# EAGLE design avrisp (EAGLE 4.15)
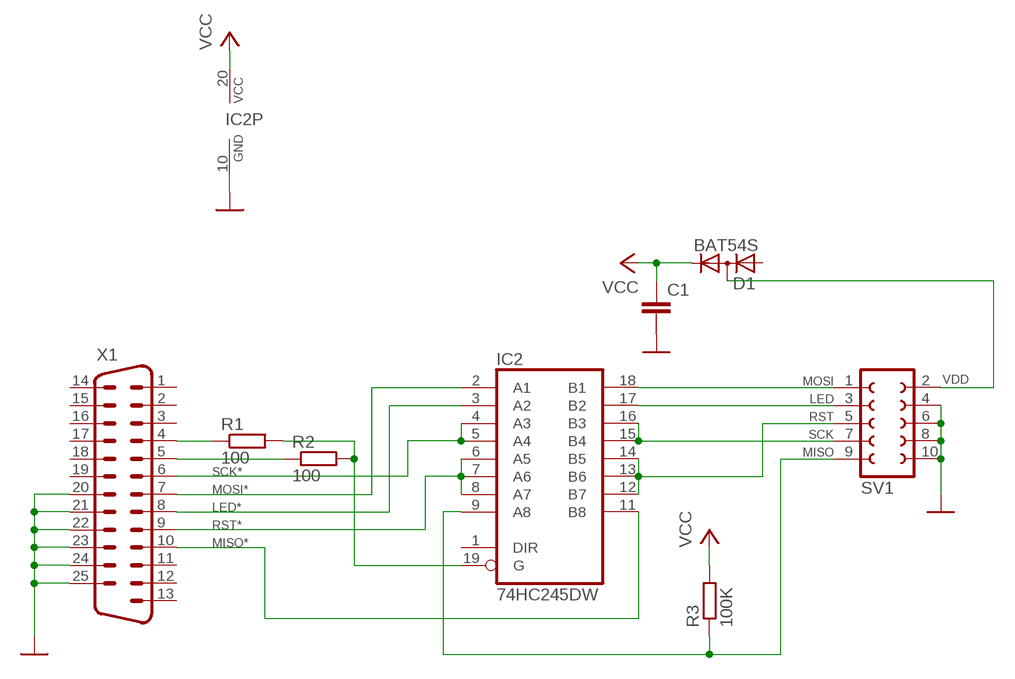
[diagram p0: schematic, sheet 1]

## Parts
C1  C-EUC0805  [C0805]
D1  BAT54S  DIODE_2CACA-SOT23  [SOT23]
IC2  74HC245DW  [SO20W]
R1  100  R-EU_R0805  [R0805]
R2  100  R-EU_R0805  [R0805]
R3  100K  R-EU_R0805  [R0805]
SV1  FE05-2  [FE05-2]
X1  M25H  [M25H]

## Nets
GND: C1.2 IC2.10(GND) SV1.4 SV1.6 SV1.8 SV1.10 X1.20 X1.21 X1.22 X1.23 X1.24 X1.25
LED: IC2.17(B2) SV1.3
LED*: IC2.3(A2) X1.8
MISO: IC2.9(A8) R3.1 SV1.9
MISO*: IC2.11(B8) X1.10
MOSI: IC2.18(B1) SV1.1
MOSI*: IC2.2(A1) X1.7
N$1: R1.1 X1.4
N$2: R2.1 X1.5
N$3: IC2.19(G) R1.2 R2.2
RST: IC2.12(B7) IC2.13(B6) IC2.14(B5) SV1.5
RST*: IC2.6(A5) IC2.7(A6) IC2.8(A7) X1.9
SCK: IC2.15(B4) IC2.16(B3) SV1.7
SCK*: IC2.4(A3) IC2.5(A4) X1.6
VCC: C1.1 D1.2(C) IC2.20(VCC) R3.2
VDD: D1.3(AC) SV1.2
Unconnected: D1.1(A) IC2.1(DIR) X1.1 X1.2 X1.3 X1.11 X1.12 X1.13 X1.14 X1.15 X1.16 X1.17 X1.18 X1.19

## Library data of the parts
C1 = rcl:C-EU: CAPACITOR, European symbol
D1 = diode:DIODE_2CACA-: 2 Diodes - Cathode-Anode|Cathode-Anode
IC2 = 74xx-eu:74*245: Octal BUS TRANSCEIVER, 3-state
R1-R3 = rcl:R-EU_: RESISTOR, European symbol
SV1 = con-lsta:FE05-2: FEMALE HEADER
X1 = con-subd:M25: SUB-D

## Net classes
0 default: width 0.5 mm

## Board
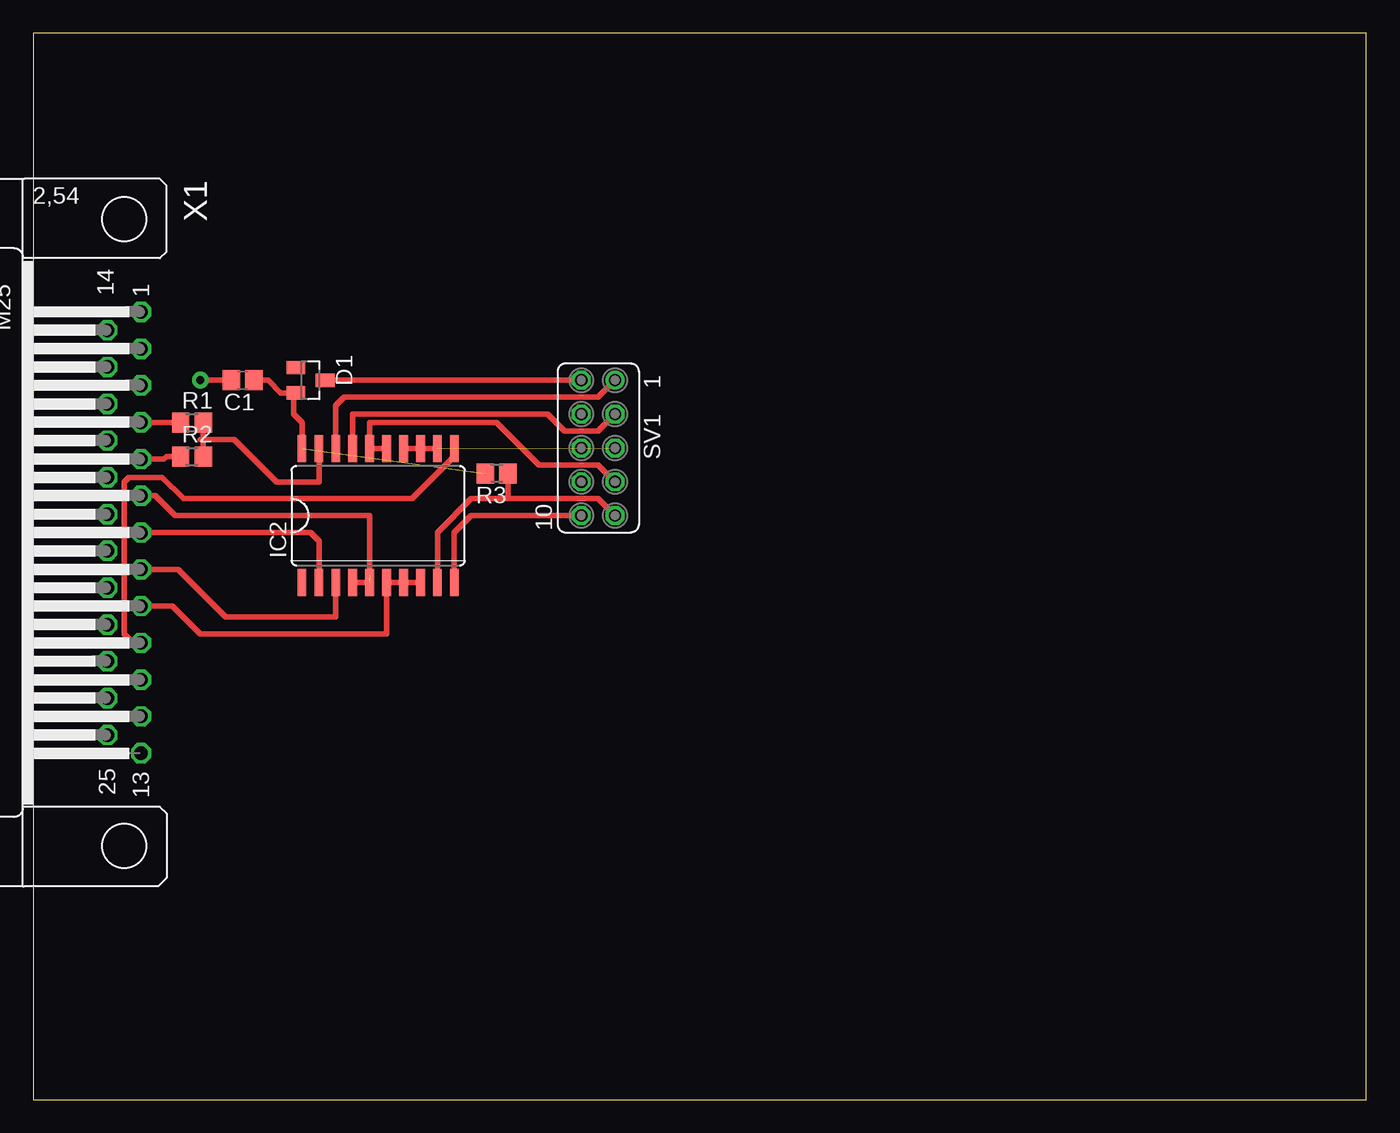
[diagram p1: board, top side]
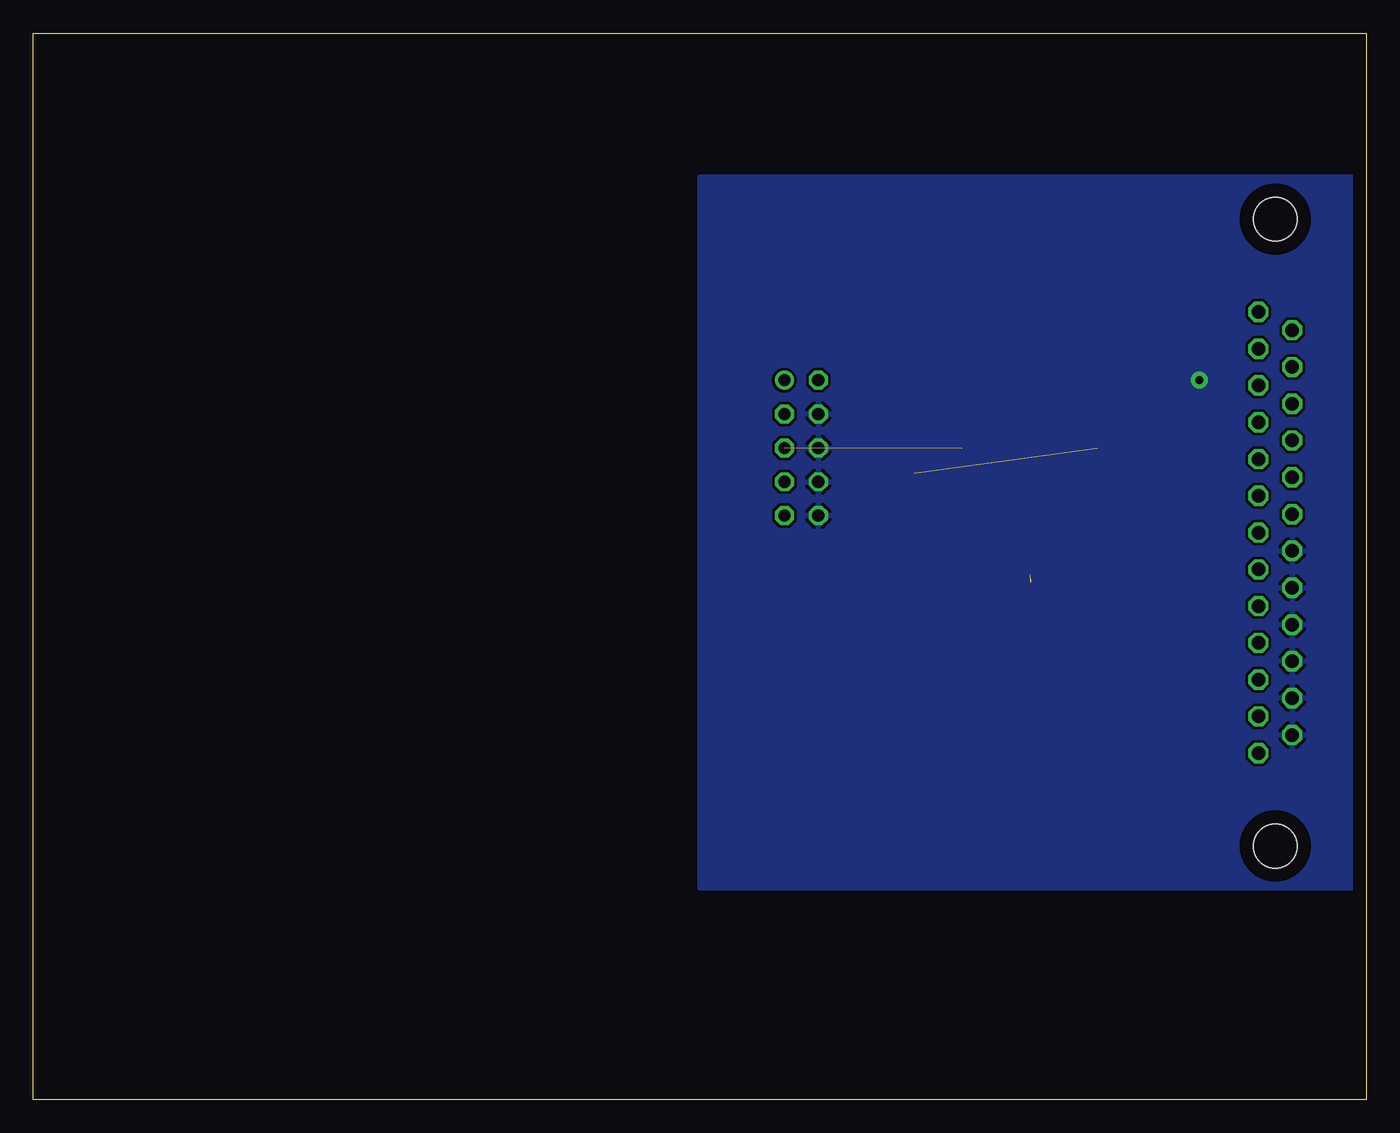
[diagram p2: board, bottom side, seen from below]

Size 100 x 80 mm. Coordinates in mm from the lower left corner, seen from the top.
Outline: 0,0 100,0 100,80 0,80 0,0
Copper layers (1*16): Top 0.035mm / dielectric 1.5mm / Bottom 0.035mm
Design rules "default": minimum track width 10mil, minimum drill 24mil, track to track 8mil, track to pad 8mil, pad to pad 8mil, via to via 8mil, smd to smd 8mil, copper to edge 40mil, drill to drill 8mil, minimum pad ring 10mil, minimum via ring 8mil, stop-mask expansion 4mil, vias tented up to drill 0mil, thermal gap 10mil

### Footprints (pad centres in the part's own frame; a part is rotated, then mirrored left to right if it is on the bottom)
C0805 = smd 1.3 x 1.5: 1 -0.85,0; 2 0.85,0
SOT23 = smd 1 x 1.4: 1 -0.95,-1.1; 2 0.95,-1.1; 3 0,1.1
SO20W = smd 0.66 x 2.032: 1 -5.715,-5.029; 2 -4.445,-5.029; 3 -3.175,-5.029; 4 -1.905,-5.029; 5 -0.635,-5.029; 6 0.635,-5.029; 7 1.905,-5.029; 8 3.175,-5.029; 9 4.445,-5.029; 10 5.715,-5.029; 11 5.715,5.029; 12 4.445,5.029; 13 3.175,5.029; 14 1.905,5.029; 15 0.635,5.029; 16 -0.635,5.029; 17 -1.905,5.029; 18 -3.175,5.029; 19 -4.445,5.029; 20 -5.715,5.029
R0805 = smd 1.3 x 1.5: 1 -0.85,0; 2 0.85,0
FE05-2 = drill 0.914 round: 1 -5.08,1.27 | drill 0.914 octagon: 2 -5.08,-1.27; 3 -2.54,1.27; 4 -2.54,-1.27; 5 0,1.27; 6 0,-1.27; 7 2.54,1.27; 8 2.54,-1.27; 9 5.08,1.27; 10 5.08,-1.27
M25H = drill 1.016 octagon: 1 -16.561,1.27; 2 -13.792,1.27; 3 -11.049,1.27; 4 -8.28,1.27; 5 -5.512,1.27; 6 -2.769,1.27; 7 0,1.27; 8 2.769,1.27; 9 5.512,1.27; 10 8.28,1.27; 11 11.049,1.27; 12 13.792,1.27; 13 16.561,1.27; 14 -15.189,-1.27; 15 -12.421,-1.27; 16 -9.652,-1.27; 17 -6.909,-1.27; 18 -4.14,-1.27; 19 -1.372,-1.27; 20 1.372,-1.27; 21 4.14,-1.27; 22 6.909,-1.27; 23 9.652,-1.27; 24 12.421,-1.27; 25 15.189,-1.27 | hole 3.302: 23.52,0; -23.52,0

### Placement (x,y rotation side)
C1  15.71,53.97 180 top
D1  20.79,53.97 270 top
IC2  25.87,43.81 0 top
R1  11.9,50.8 0 top
R2  11.9,48.26 0 top
R3  34.76,46.98 180 top
SV1  42.38,48.89 270 top
X1  6.82,42.54 270 top

### Tracks (layer width: path | path; a pad name or v marks a point on that pad's centre or on a via)
GND  (via drill 0.6 pad 1.27)
  Top 0.406: v12.54,53.97 C1.2 | SV1.10 32.85,43.81 31.58,42.54 IC2.10 31.58,38.73
  pour Bottom: 0.47,69.21 0.47,15.87 50,15.87 50,69.21
LED
  Top 0.406: IC2.17 23.96,51.43 38.57,51.43 39.84,50.16 42.38,50.16 SV1.3
LED*
  Top 0.406: IC2.3 22.7,36.19 14.44,36.19 10.86,39.77 X1.8
MISO
  Top 0.406: IC2.9 30.31,42.54 32.85,45.08 35.39,45.08 | 35.39,45.08 42.38,45.08 SV1.9 | R3.1 35.61,45.3 35.39,45.08
MISO*
  Top 0.406: IC2.11 31.58,48.26 28.41,45.08 11.27,45.08 9.68,46.67 7.14,46.67 6.82,46.35 6.82,34.92 7.48,34.26 X1.10
MOSI
  Top 0.406: SV1.1 42.38,52.7 23.33,52.7 22.7,52.07 IC2.18
MOSI*
  Top 0.406: X1.7 20.79,42.54 21.42,41.91 IC2.2 21.42,38.73
N$1
  Top 0.406: X1.4 8.09,50.8 R1.1
N$2
  Top 0.406: X1.5 9.79,48.05 10,48.26 R2.1 11.27,48.26
N$3
  Top 0.406: R2.2 13.17,48.26 12.75,48.68 12.75,49.53 | 12.75,49.53 R1.2 | IC2.19 21.42,46.35 18.25,46.35 15.08,49.53 12.75,49.53 | 12.75,49.53 12.54,49.53
RST  (1 unrouted)
  Top 0.406: IC2.12 30.31,48.89 30.26,48.84 IC2.13 | IC2.14 IC2.13 | IC2.13 29.04,48.89
RST*
  Top 0.406: IC2.8 29.04,38.73 28.99,38.78 IC2.7 | IC2.6 IC2.7 | IC2.7 27.77,38.73 27.72,38.78 IC2.6 | IC2.6 26.5,34.92 12.54,34.92 10.43,37.03 X1.9
SCK
  Top 0.406: 25.23,48.89 25.23,50.8 34.76,50.8 37.94,47.62 42.38,47.62 SV1.7 | IC2.16 25.23,48.89 | IC2.15 25.29,48.84 25.23,48.89
SCK*  (1 unrouted)
  Top 0.406: 25.23,39.37 25.23,43.81 10.63,43.81 9.13,45.31 X1.6 | IC2.5 25.23,38.73 25.18,38.78 IC2.4
VCC  (1 unrouted)
  Top 0.406: C1.1 17.61,53.97 18.56,53.02 D1.2 19.69,53.16 19.52,53.34 19.52,51.43 20.15,50.8 IC2.20
VDD
  Top 0.406: D1.3 SV1.2